# EAGLE design ADC_Analog_Input_Scaler_UPDATED2018 (EAGLE 8.4.1)
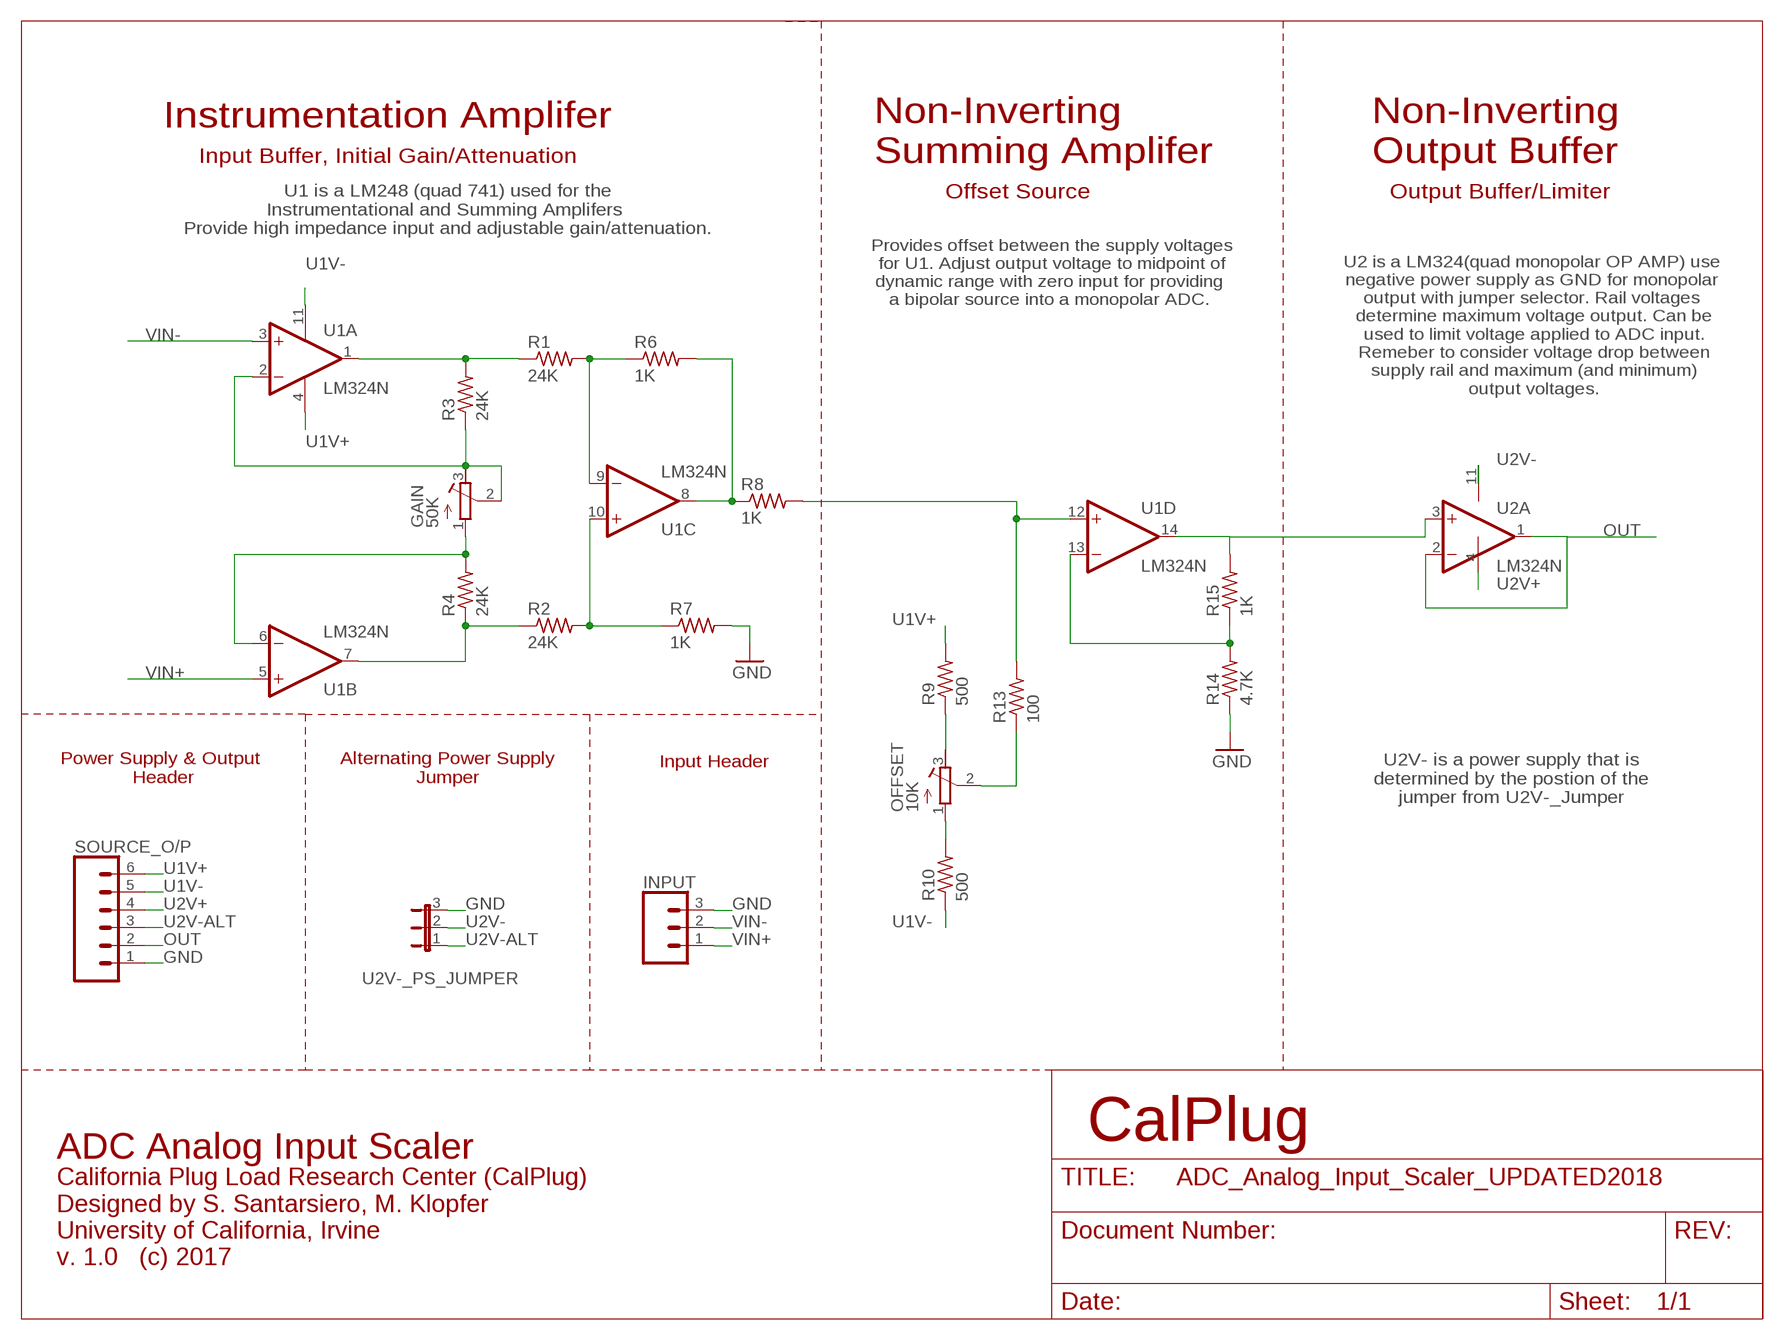
[diagram p0: schematic, sheet 1]

## Parts
GAIN  50K  R-TRIMM3296W  [RTRIM3296W]
INPUT  CONN_03  [1X03]
OFFSET  10K  R-TRIMM3296W  [RTRIM3296W]
R1  24K  R-US_R1210  [R1210]
R2  24K  R-US_R1210  [R1210]
R3  24K  R-US_R1210  [R1210]
R4  24K  R-US_R1210  [R1210]
R6  1K  R-US_R1210  [R1210]
R7  1K  R-US_R1210  [R1210]
R8  1K  R-US_R1210  [R1210]
R9  500  R-US_R1206  [R1206]
R10  500  R-US_R1206  [R1206]
R13  100  R-US_R1210  [R1210]
R14  4.7K  R-US_R1210  [R1210]
R15  1K  R-US_R1210  [R1210]
SOURCE_O/P  CONN_06LOCK  [1X06_LOCK]
U1  LM324N  [DIL14]
U2  LM324N  [DIL14]
U2V-_PS_JUMPER  JP2E  [JP2]

## Nets
GND: INPUT.3 R7.2 R14.1 SOURCE_O/P.1 U2V-_PS_JUMPER.3
N$2: GAIN.1(A) R4.2 U1.6(B:-IN)
N$3: R1.1 R3.2 U1.1(A:OUT)
N$4: R2.1 R4.1 U1.7(B:OUT)
N$5: R1.2 R6.1 U1.9(C:-IN)
N$6: OFFSET.1(A) R10.2
N$7: R6.2 R8.1 U1.8(C:OUT)
N$8: R2.2 R7.1 U1.10(C:+IN)
N$9: OFFSET.3(E) R9.1
N$10: GAIN.2(S) GAIN.3(E) R3.1 U1.2(A:-IN)
N$11: R8.2 R13.2 U1.12(D:+IN)
N$12: OFFSET.2(S) R13.1
N$13: R15.2 U1.14(D:OUT) U2.3(A:+IN)
N$14: R14.2 R15.1 U1.13(D:-IN)
OUT: SOURCE_O/P.2 U2.1(A:OUT) U2.2(A:-IN)
U1V+: R9.2 SOURCE_O/P.6 U1.4(P:V+)
U1V-: R10.1 SOURCE_O/P.5 U1.11(P:V-)
U2V+: SOURCE_O/P.4 U2.4(P:V+)
U2V-: U2.11(P:V-) U2V-_PS_JUMPER.2
U2V-ALT: SOURCE_O/P.3 U2V-_PS_JUMPER.1
VIN+: INPUT.1 U1.5(B:+IN)
VIN-: INPUT.2 U1.3(A:+IN)
Unconnected: U2.5(B:+IN) U2.6(B:-IN) U2.7(B:OUT) U2.8(C:OUT) U2.9(C:-IN) U2.10(C:+IN) U2.12(D:+IN) U2.13(D:-IN) U2.14(D:OUT)

## Notes on the sheet
- Instrumentation Amplifer
- Input Buffer, Initial Gain/Attenuation
- Non-Inverting
  Summing Amplifer
- Non-Inverting
  Output Buffer
- Offset Source | Output Buffer/Limiter
- U1 is a LM248 (quad 741) used for the
  Instrumentational and Summing Amplifers 
  Provide high impedance input and adjustable gain/attenuation.
- Provides offset between the supply voltages
   for U1. Adjust output voltage to midpoint of 
  dynamic range with zero input for providing 
  a bipolar source into a monopolar ADC.
- U2 is a LM324(quad monopolar OP AMP) use
   negative power supply as GND for monopolar 
  output with jumper selector. Rail voltages
   determine maximum voltage output. Can be
   used to limit voltage applied to ADC input.
   Remeber to consider voltage drop between
   supply rail and maximum (and minimum)
   output voltages.
- Power Supply & Output 
  Header
- Alternating Power Supply
  Jumper
- Input Header
- U2V- is a power supply that is 
  determined by the postion of the 
  jumper from U2V-_Jumper
- CalPlug
- ADC Analog Input Scaler
- California Plug Load Research Center (CalPlug)
  Designed by S. Santarsiero, M. Klopfer
  University of California, Irvine
  v. 1.0   (c) 2017

## Library data of the parts
GAIN OFFSET = rcl:R-TRIMM: Trimm resistor
INPUT = SparkFun-Connectors:CONN_03: Multi connection point. Often used as Generic Header-pin footprint for 0.1 inch spaced/style header connections On any of the 0.1 inch spaced packages, you can populate with these: Break Away Headers - Straight <https://www.sparkfun.com/products/116> (PRT-00116) Break Away Male Headers - Right Angle <https://www.sparkfun.com/products/553> (PRT-00553) Female Headers <https://www.sparkfun.com/products/115> (PRT-00115) Break Away Headers - Machine Pin <https://www.sparkfun.com/products/117> (PRT-00117) Break Away Female Headers - Swiss Machine Pin <https://www.sparkfun.com/products/743> (PRT-00743) Stackable Header - 3 Pin (Female, 0.1") <https://www.sparkfun.com/products/13875> (PRT-13875) For SCREWTERMINALS and SPRING TERMINALS visit here: Screw Terimnals on SparkFun.com <https://www.sparkfun.com/search/results?term=Screw+Terminals> (5mm/3.5mm/2.54mm spacing) This device is also useful as a general connection point to wire up your design to another part of your project. Our various solder wires solder well into these plated through hole pads. Hook-Up Wire - Assortment (Stranded, 22 AWG) <https://www.sparkfun.com/products/11375> (PRT-11375) Hook-Up Wire - Assortment (Solid Core, 22 AWG) <https://www.sparkfun.com/products/11367> (PRT-11367) View the entire wire category on our website here <https://www.sparkfun.com/categories/141> Special notes: Molex polarized connector foot print use with SKU : PRT-08232 with associated crimp pins and housings.
R1-R4 R6-R10 R13-R15 = rcl:R-US_: RESISTOR, American symbol
SOURCE_O/P = SparkFun-Connectors:CONN_06: Multi connection point. Often used as Generic Header-pin footprint for 0.1 inch spaced/style header connections On any of the 0.1 inch spaced packages, you can populate with these: Break Away Headers - Straight <https://www.sparkfun.com/products/116> (PRT-00116) Break Away Male Headers - Right Angle <https://www.sparkfun.com/products/553> (PRT-00553) Female Headers <https://www.sparkfun.com/products/115> (PRT-00115) Break Away Headers - Machine Pin <https://www.sparkfun.com/products/117> (PRT-00117) Break Away Female Headers - Swiss Machine Pin <https://www.sparkfun.com/products/743> (PRT-00743) Arduino Stackable Header - 6 Pin <https://www.sparkfun.com/products/9280> (PRT-09280) For SCREWTERMINALS and SPRING TERMINALS visit here: Screw Terimnals on SparkFun.com <https://www.sparkfun.com/search/results?term=Screw+Terminals> (5mm/3.5mm/2.54mm spacing) This device is also useful as a general connection point to wire up your design to another part of your project. Our various solder wires solder well into these plated through hole pads. Hook-Up Wire - Assortment (Stranded, 22 AWG) <https://www.sparkfun.com/products/11375> (PRT-11375) Hook-Up Wire - Assortment (Solid Core, 22 AWG) <https://www.sparkfun.com/products/11367> (PRT-11367) View the entire wire category on our website here <https://www.sparkfun.com/categories/141>
U1 U2 = linear:LM324: OP AMP
U2V-_PS_JUMPER = jumper:JP2E: JUMPER

## Board
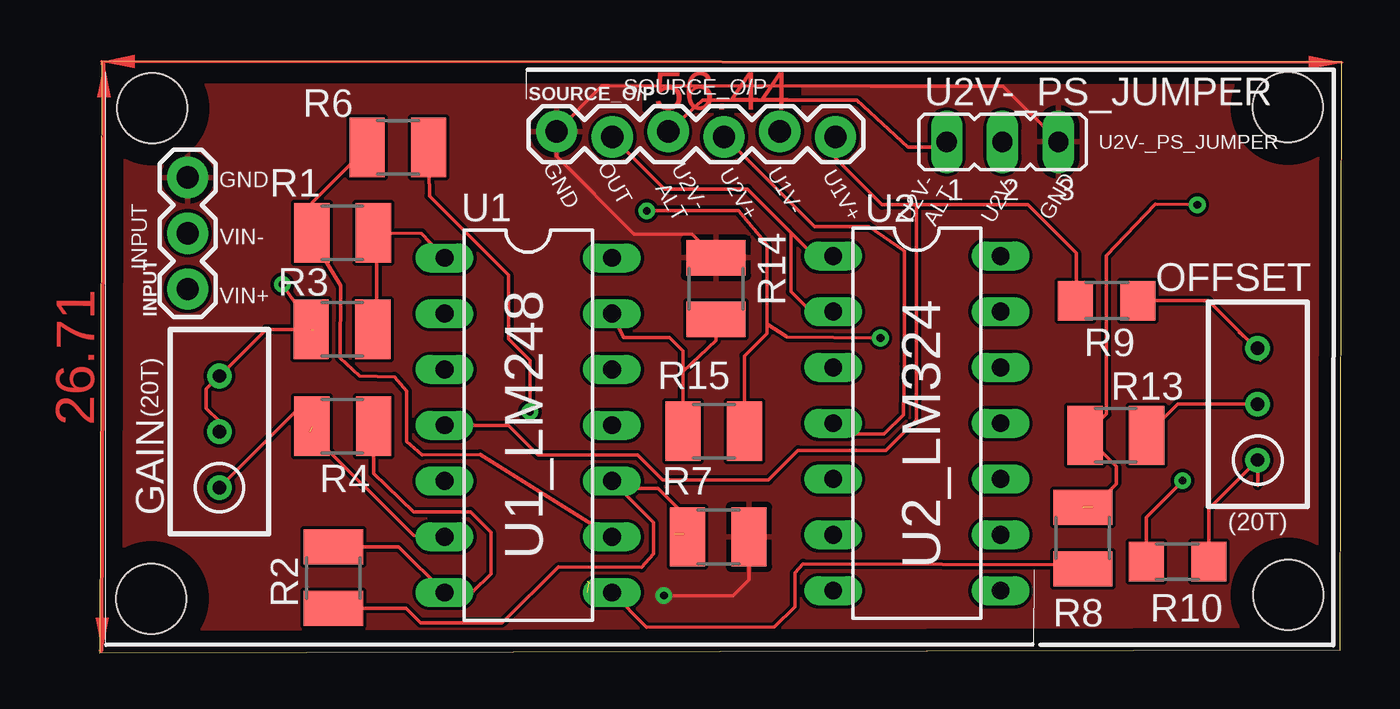
[diagram p1: board, top side]
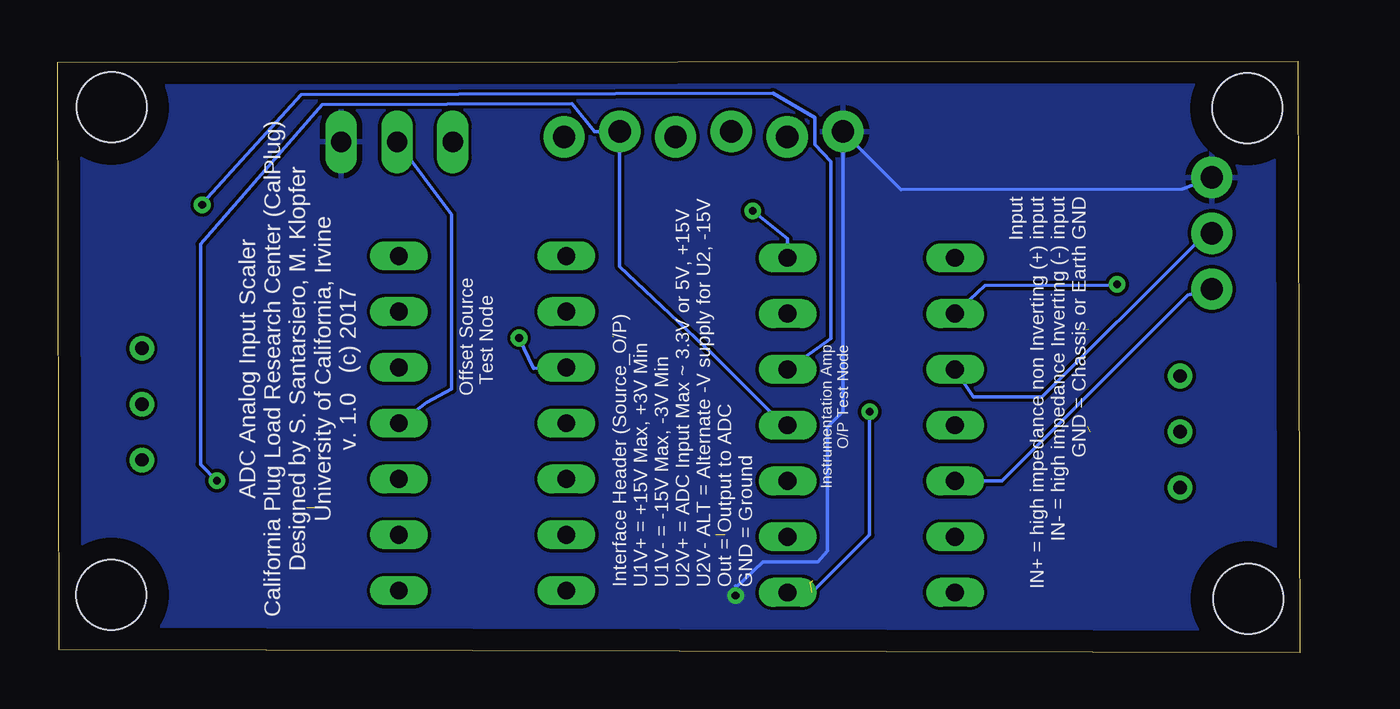
[diagram p2: board, bottom side, seen from below]

Size 56.52 x 26.92 mm. Coordinates in mm from the lower left corner, seen from the top.
Outline: 0,0 56.46,0.13 56.52,26.87 0.08,26.92 0,0
Copper layers (1*16): Top 0.035mm / dielectric 1.5mm / Bottom 0.035mm
Design rules "default": minimum track width 6mil, minimum drill 0.35mm, track to track 6mil, track to pad 6mil, pad to pad 6mil, via to via 6mil, smd to smd 6mil, copper to edge 40mil, drill to drill 6mil, minimum pad ring 10mil, minimum via ring 8mil, stop-mask expansion 4mil, vias tented up to drill 0mil, thermal gap 10mil
Holes 3.17 mm at 2.38,24.79 54.07,24.83 54.09,2.63 2.34,2.45

### Footprints (pad centres in the part's own frame; a part is rotated, then mirrored left to right if it is on the bottom)
RTRIM3296W = drill 0.61: 1 0,-2.54; 2 0,0; 3 0,2.54
1X03 = drill 1.016 pad 1.88: 1 0,0; 2 2.54,0; 3 5.08,0
R1210 = smd 1.6 x 2.7: 1 -1.4,0; 2 1.4,0
R1206 = smd 1.6 x 1.803: 1 -1.422,0; 2 1.422,0
1X06_LOCK = drill 1.016 pad 1.88: 1 0,0; 2 2.54,-0.254; 3 5.08,0; 4 7.62,-0.254; 5 10.16,0; 6 12.7,-0.254
DIL14 = drill 0.813 long: 1 -7.62,-3.81; 2 -5.08,-3.81; 3 -2.54,-3.81; 4 0,-3.81; 5 2.54,-3.81; 6 5.08,-3.81; 7 7.62,-3.81; 8 7.62,3.81; 9 5.08,3.81; 10 2.54,3.81; 11 0,3.81; 12 -2.54,3.81; 13 -5.08,3.81; 14 -7.62,3.81
JP2 = drill 0.914 long: 1 -2.54,0; 2 0,0; 3 2.54,0

### Placement (x,y rotation side)
GAIN  5.44,10.05 0 top
INPUT  4,16.55 90 top
OFFSET  52.7,11.31 0 top
R1  11.04,19.11 180 top
R2  10.62,3.41 270 top
R3  11.02,14.72 0 top
R4  11.05,10.3 180 top
R6  13.56,23 0 top
R7  28.14,5.27 0 top
R8  44.74,5.2 90 top
R9  45.82,16.02 180 top
R10  49.04,4.15 0 top
R13  46.24,9.89 180 top
R14  28.04,16.57 270 top
R15  27.93,10.07 0 top
SOURCE_O/P  20.78,23.73 0 top
U1  19.49,10.35 270 top
U2  37.18,10.44 270 top
U2V-_PS_JUMPER  41.08,23.25 0 top

### Tracks (layer width: path | path; a pad name or v marks a point on that pad's centre or on a via)
GND  (via drill 0.35)
  Top 0.152: 20.97,23.73 SOURCE_O/P.1 | SOURCE_O/P.1 22.86,25.81 23.14,25.81 35.08,25.8 41.11,25.79 43.64,23.26 U2V-_PS_JUMPER.3 | SOURCE_O/P.1 21.14,23.73 | 29.01,18.48 29.01,18.53 | 29.01,18.48 29.01,18.4 | R7.2 29.54,3.32 28.8,2.58 25.68,2.58 v25.67,2.59 | R14.1 28.5,17.98 29.01,18.48 | R14.1 27.8,17.98 | SOURCE_O/P.1 20.78,22.6 24.32,19.06 26.95,19.06 R14.1
  Bottom 0.152: INPUT.3 5.34,21.09 18.13,21.08 SOURCE_O/P.1 20.78,10.97 21.48,10.27 21.48,4.63 21.91,4.13 24.43,4.12 25.67,2.95 v25.67,2.59 25.67,3.03
  pour Bottom: 56.76,26.84 56.55,0.35 56.56,0.09 0.01,0.06 0.14,26.84 0.14,26.79
  pour Top: 56.67,26.81 56.42,0.05 0,0.08 0.09,26.8
N$2  (1 unrouted)
  Top 0.152: U1.6 14.28,5.34 9.55,10.05 | GAIN.1 8.88,10.96 R4.2
N$3
  Top 0.152: 12.6,14.86 12.89,15.09 | 12.6,14.86 R3.2 | U1.1 14.65,19.08 R1.1 12.6,18.95 12.6,14.86
N$4
  Top 0.152: R2.1 10.65,4.79 11.02,4.79 | 10.65,4.94 R2.1 | R2.1 13.6,4.81 U1.7 16.94,2.73 17.79,3.58 17.79,5.48 16.87,6.41 14.28,6.41 12.45,8.17 R4.1
N$5
  Top 0.152: R6.1 9.66,20.48 R1.2 9.82,18.58 10.96,16.72 10.92,13.42 11.81,12.6 13.41,12.55 13.96,11.9 13.96,9.62 14.67,8.99 17.29,9.03 U1.9
N$6
  Top 0.152: 52.7,7.61 OFFSET.1 50.47,6.54 R10.2
N$7  (via drill 0.35)  (3 unrouted)
  Top 0.152: R6.2 15,20.79 18.59,17.2 18.59,14.28 19.57,13.3 v19.57,10.96 | 44.69,4 R8.1 | 44.69,4 44.18,3.83 | 23.86,2.25 U1.8 24.88,1.15 30.71,1.16 31.63,2.09 31.63,3.62 32,4.04 44.69,4
  Bottom 0.152: U1.8 22.19,2.73 19.57,5.35 v19.57,10.96
N$8  (1 unrouted)
  Top 0.152: 10.55,1.3 10.6,1.79 10.62,1.81 R2.2 13.94,2.01 14.59,1.36 18.3,1.36 20.88,3.9 24.65,3.88 25.19,4.49 25.19,5.92 U1.10 23.64,7.47 25.4,7.47 26.75,6.13 R7.1 26.64,5.37 26.59,5.37 | 26.05,5.27 26.15,5.37
N$9
  Top 0.152: 52.81,13.32 OFFSET.3 52.15,14.33 | 52.15,14.33 51.86,14.58 | R9.1 50.45,16.02 52.15,14.33
N$10  (via drill 0.35)  (1 unrouted)
  Top 0.152: GAIN.2 5.44,10.52 4.84,11.13 4.84,11.99 GAIN.3 7.56,14.72 R3.1 | v8.3,16.77 9.73,14.7
  Bottom 0.152: U1.2 14.32,16.72 8.33,16.74 v8.3,16.77
N$11  (via drill 0.35)  (1 unrouted)
  Top 0.152: 45.18,6.6 46.26,7.68 46.26,8.47 R13.2 45.81,10.86 45.81,18.09 48.05,20.42 v49.95,20.39
  Bottom 0.152: U1.12 21.34,14.3 21.34,22.36 22.06,23.14 22.06,24.35 23.97,25.47 45.45,25.39 49.95,20.43 v49.95,20.39
N$12
  Top 0.152: R13.1 49.06,11.31 OFFSET.2
N$13  (via drill 0.35)  (1 unrouted)
  Top 0.152: 30.36,14.97 30.36,14.54 29.33,13.51 R15.2 | 30.36,14.97 30.36,18.58 29.06,20.12 24.58,20.12 v24.89,20.11 | 30.36,14.97 31.25,14.38 | 31.28,14.38 v35.52,14.32
  Bottom 0.152: v24.89,20.11 23.3,18.84 U1.14 | U2.3 34.86,12.93 v35.52,14.32
N$14
  Top 0.152: R15.1 26.53,12.79 | 26.53,12.79 26.53,13.74 25.92,14.35 23.83,14.35 U1.13 | 27.76,14.86 28.04,15.14 R14.2 28.04,14.21 26.53,12.79
OUT
  Top 0.152: 23.51,23.47 SOURCE_O/P.2 25.69,21.1 29.48,21.1 31.27,19.31 | 31.27,19.31 32.52,18.06 U2.1 | 31.27,19.31 31.45,19.13 31.45,16.43 32.36,15.52 U2.2
U1V+  (1 unrouted)
  Top 0.152: 37.17,20.4 42.24,20.4 44.43,18.2 44.43,16.06 R9.2 | 37.17,20.4 35.6,20.4 33.48,22.52 SOURCE_O/P.6 | U1.4 18.59,10.35 19.95,9 24.47,9 25.38,8.08 | 25.38,8.08 25.6,7.86 30.44,7.86 31.78,9.2 35.79,9.2 37.17,10.59 37.17,20.4
U1V-  (via drill 0.35)
  Top 0.152: R10.1 47.62,6.17 v49.28,7.83
  Bottom 0.152: U1.11 23.35,10.4 23.53,10.4 26.72,13.59 30.94,17.57 SOURCE_O/P.5 32.08,23.73 33.12,24.99 44.48,24.95 50.03,18.6 50.03,8.57 v49.28,7.83
U2V+
  Top 0.152: SOURCE_O/P.4 28.45,23.47 32.52,19.4 35,19.4 36.62,18.28 36.62,13.15 36.58,10.83 36.58,10.82 35.68,9.96 33.85,9.96 U2.4
U2V-
  Bottom 0.152: U2V-_PS_JUMPER.2 38.59,19.94 38.59,12 39.74,11.39 U2.11
U2V-ALT
  Top 0.152: SOURCE_O/P.3 27.43,25.15 34.44,25.15 | 34.44,25.15 34.52,25.07 | 34.44,25.15 36.77,23 38.29,23 U2V-_PS_JUMPER.1
VIN+
  Bottom 0.152: INPUT.1 5.07,16.28 13.55,7.81 U1.5
VIN-
  Bottom 0.152: INPUT.2 4.82,18.54 11.72,11.64 14.85,11.64 U1.3
(copper drawn outside any net)
  shapes: Top area x2

### Text on the board
tPlace: SOURCE_O/P | U2V-_PS_JUMPER | GND | U2V- / ALT | GND | OUT | U2V- / ALT | U2V+ | U1V- | U1V+ | U2V- | GND | VIN- | INPUT | VIN+ | (20T) | (20T) | U1_LM248 | U2_LM324
bPlace: Input / IN+ = high impedance non Inverting (+) input / IN- = high impedance Inverting (-) input / GND = Chassis or Earth GND | Instrumentation Amp / O/P Test Node | ADC Analog Input Scaler / California Plug Load Research Center (CalPlug) / Designed by S. Santarsiero, M. Klopfer / University of California, Irvine / v. 1.0 (c) 2017 | Offset Source / Test Node | Interface Header (Source_O/P) / U1V+ = +15V Max, +3V Min / U1V- = -15V Max, -3V Min / U2V+ = ADC Input Max ~ 3.3V or 5V, +15V / U2V- ALT = Alternate -V supply for U2, -15V / Out = Output to ADC / GND = Ground